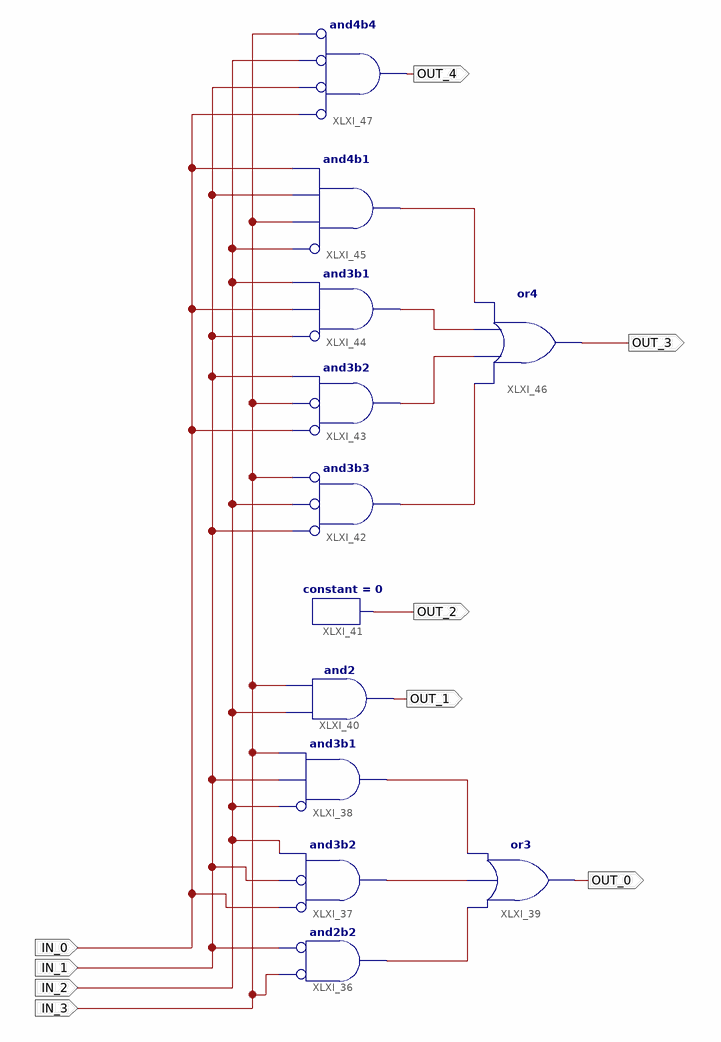
[diagram p0: schematic sheet 1]
// Xilinx ISE schematic dec.sch (spartan3a) as structural Verilog: 12 symbols, 9 ports
module dec (
  input  IN_3,
  input  IN_2,
  input  IN_1,
  input  IN_0,
  output OUT_0,
  output OUT_1,
  output OUT_2,
  output OUT_3,
  output OUT_4
);

  wire XLXN_83, XLXN_84, XLXN_86, XLXN_94, XLXN_95, XLXN_96, XLXN_97;

  and XLXI_36 (XLXN_86, ~IN_3, ~IN_1);  // and2b2
  and XLXI_37 (XLXN_84, ~IN_0, ~IN_1, IN_2);  // and3b2
  and XLXI_38 (XLXN_83, ~IN_2, IN_1, IN_3);  // and3b1
  or XLXI_39 (OUT_0, XLXN_86, XLXN_84, XLXN_83);
  and XLXI_40 (OUT_1, IN_2, IN_3);
  constant #(.CValue("0")) XLXI_41 (.O(OUT_2));
  and XLXI_42 (XLXN_97, ~IN_1, ~IN_2, ~IN_3);  // and3b3
  and XLXI_43 (XLXN_96, ~IN_0, ~IN_3, IN_1);  // and3b2
  and XLXI_44 (XLXN_95, ~IN_1, IN_0, IN_2);  // and3b1
  and XLXI_45 (XLXN_94, ~IN_2, IN_3, IN_1, IN_0);  // and4b1
  or XLXI_46 (OUT_3, XLXN_97, XLXN_96, XLXN_95, XLXN_94);
  and XLXI_47 (OUT_4, ~IN_0, ~IN_1, ~IN_2, ~IN_3);  // and4b4
endmodule
